# Altium schematic sheet [02] - BLOCK DIAGRAM.SchDoc
size A3; DocumentNumber: 2; SheetNumber: 2; SheetTotal: 9
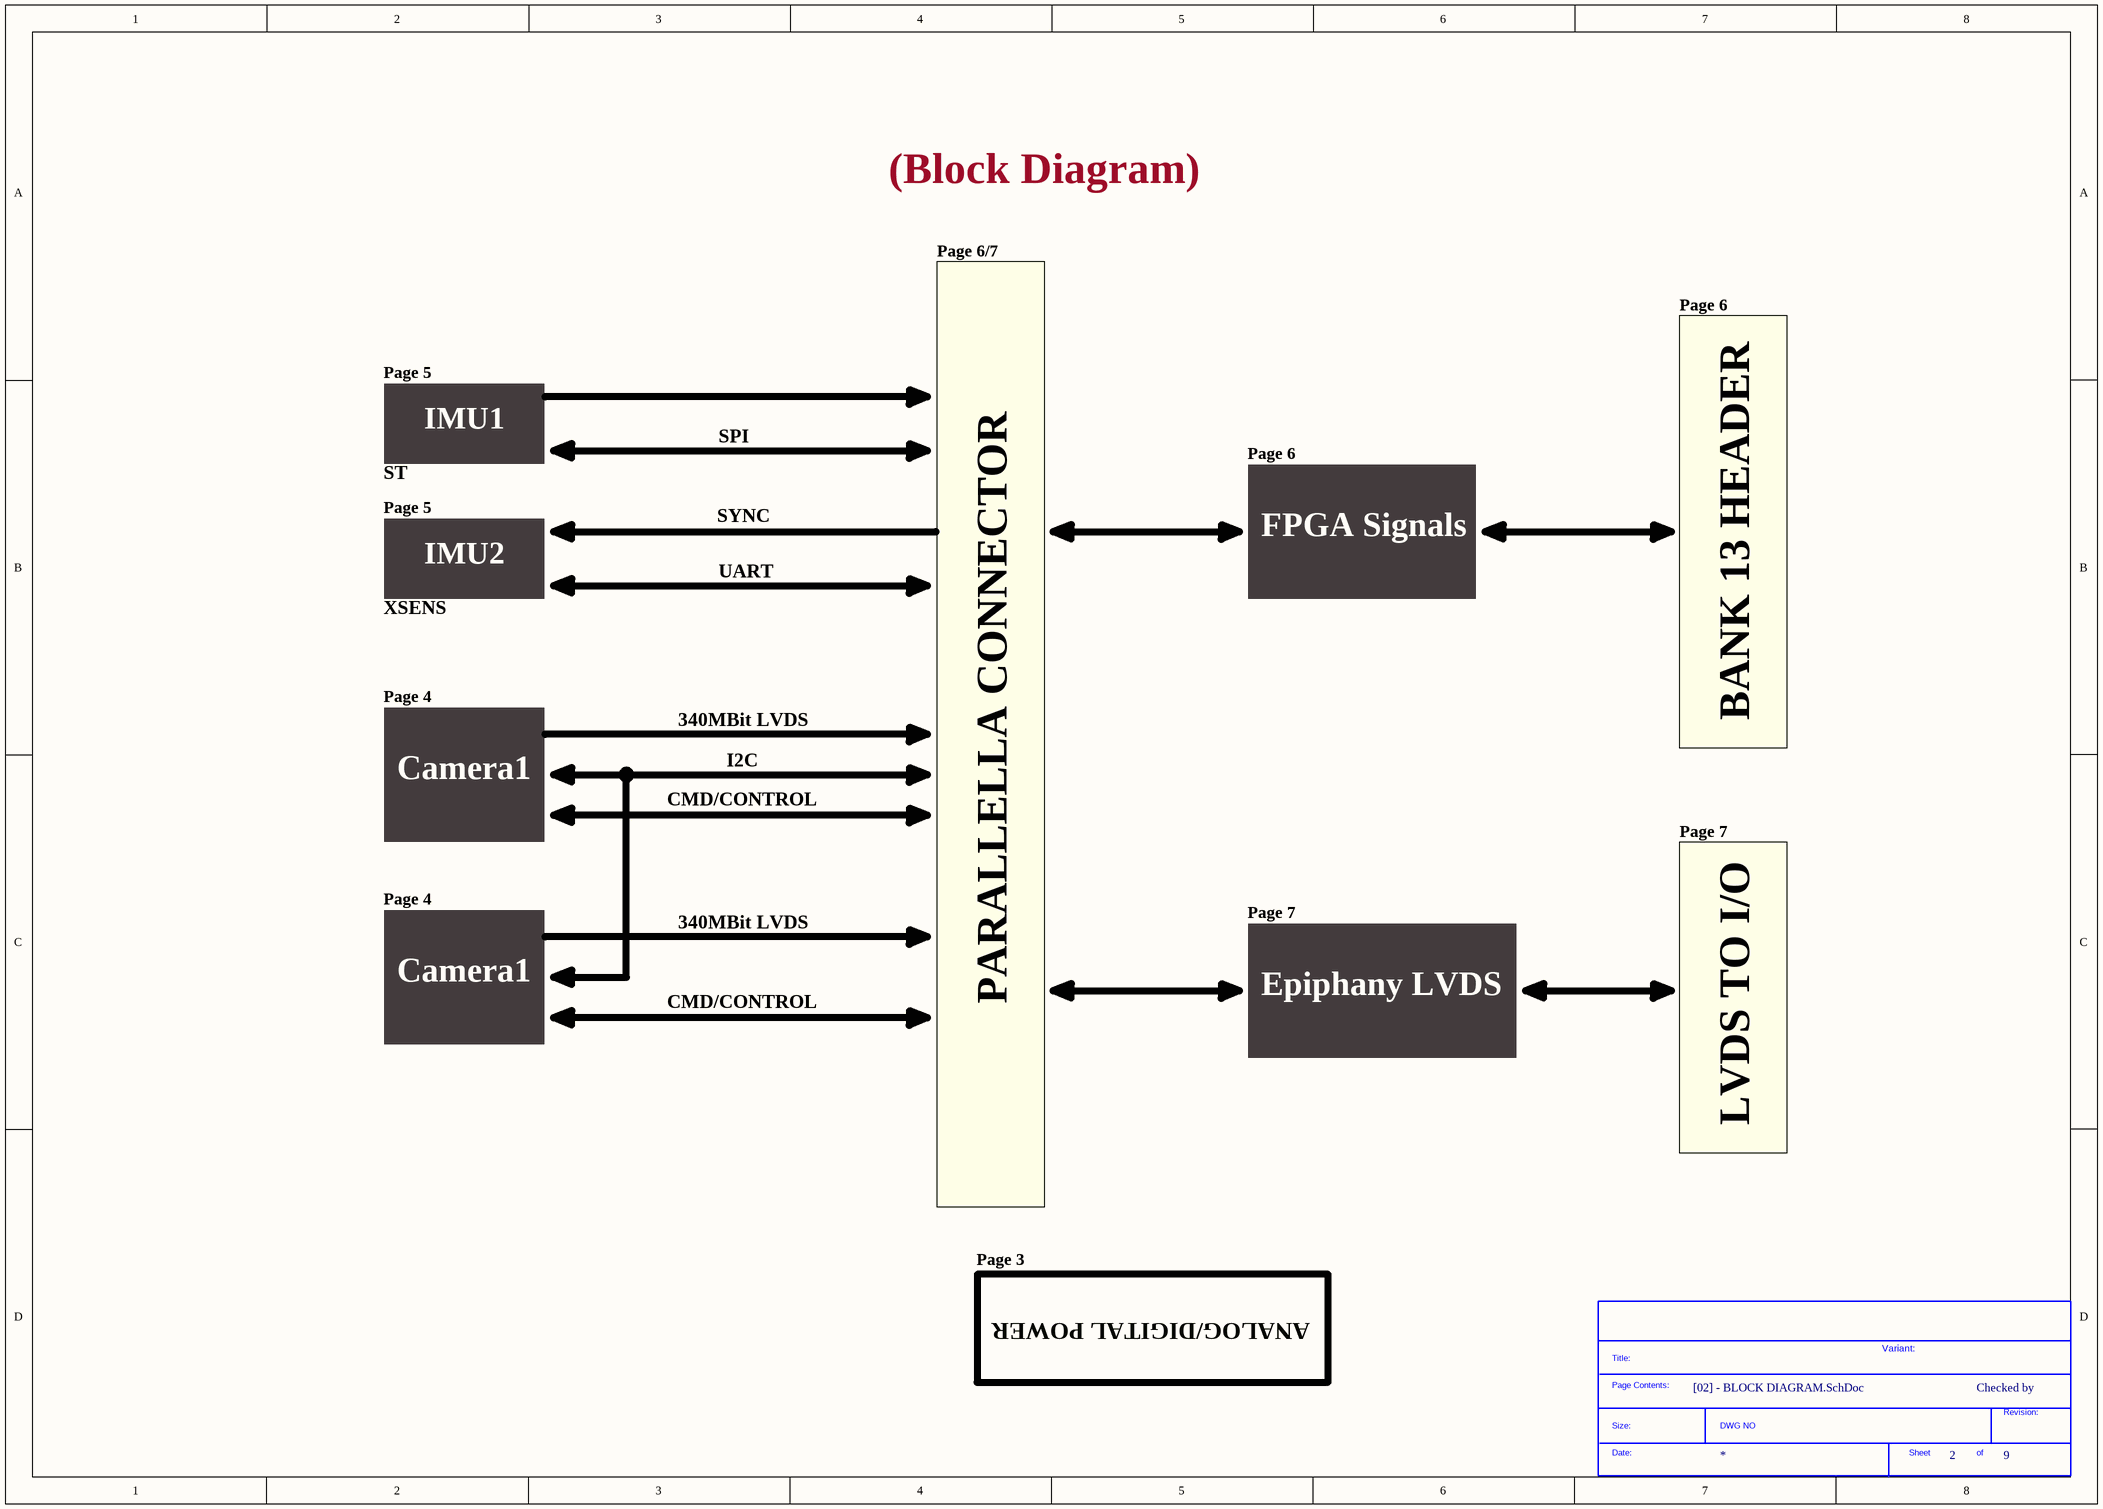
[diagram p0: [02] - BLOCK DIAGRAM.SchDoc]

## Parts
*  SDTitleBlock  (value not drawn)  (graphical)

## Notes on the sheet
- (Block Diagram)
- Page 6/7
- Page 6
- Page 5
- IMU1
- SPI
- ST
- IMU2
- SYNC
- UART
- FPGA Signals
- XSENS
- Page 4
- BANK 13 HEADER
- Camera1
- 340MBit LVDS
- I2C
- CMD/CONTROL
- Page 7
- PARALLELLA CONNECTOR
- Epiphany LVDS
- LVDS TO I/O
- Page 3
- ANALOG/DIGITAL POWER
- CLOCKS (CPU & PCIE)
- Variant:
- Checked by
- (in symbol SDTitleBlock) Title:; Page Contents:; Revision:; Size:; DWG NO; Date:; Sheet; of